# Altium project SmokeDetector.PrjPcb
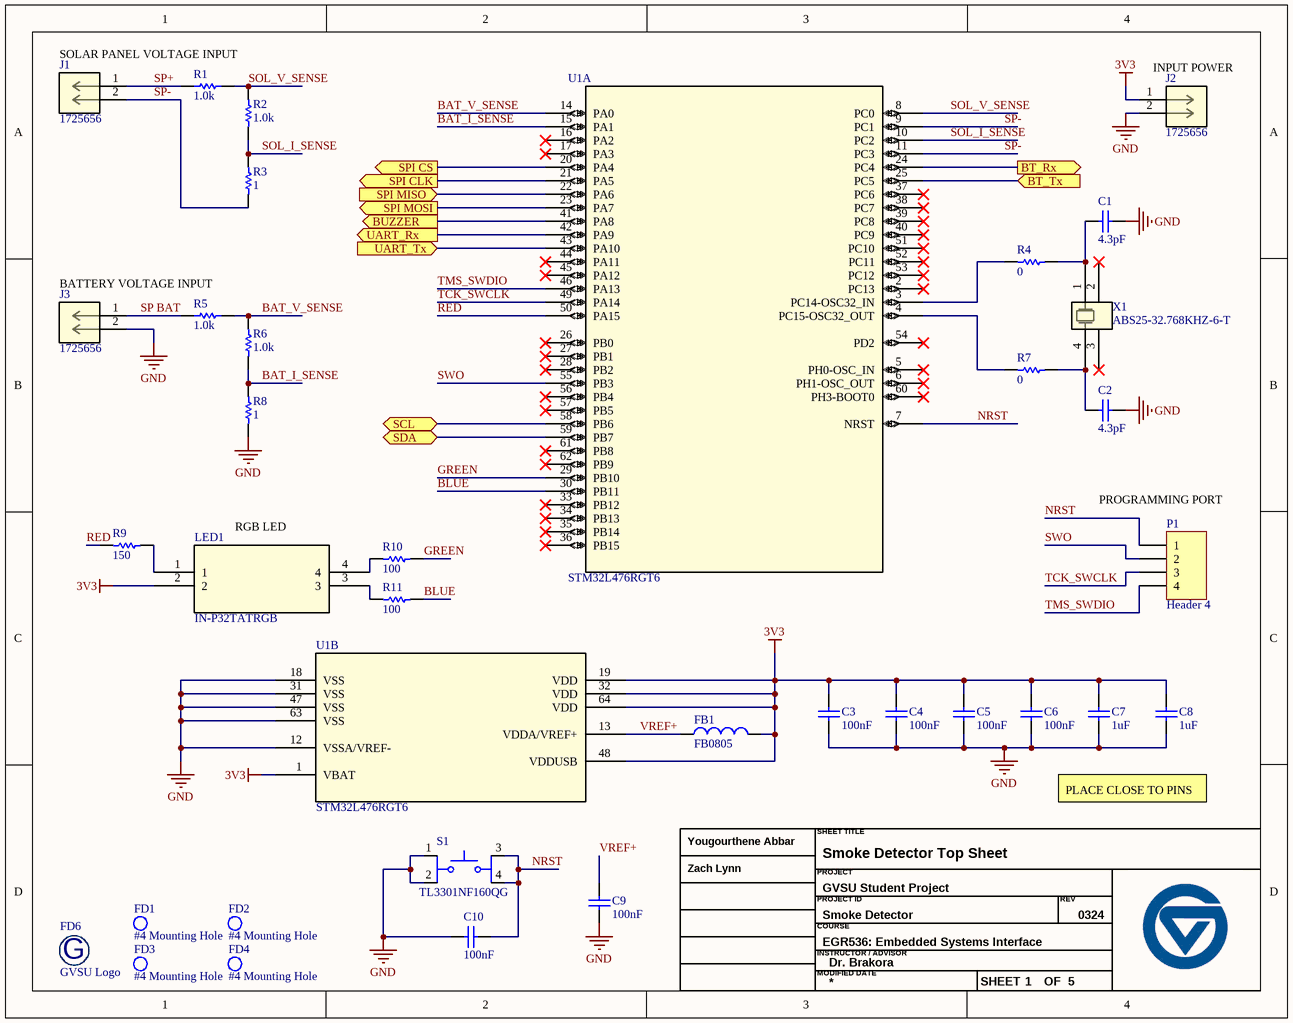
[diagram p0: SmokeDetector.SchDoc]
revision: 0324; release_date: Jan. 1, 1970; project_name: GVSU Student Project; project_id: Smoke Detector; member2: Zach Lynn; member1: Yougourthene Abbar; instructor: Dr. Brakora; gvsu_address3: 49504; gvsu_address2: 301 Fulton St. W, Grand Rapids MI; gvsu_address1: Kennedy Hall of Engineering; course: EGR536: Embedded Systems Interface
4 sheets, 62 parts. Net scope: flat (ports and power ports of the same name join across sheets).
Board file: SmokeDetector.PcbDoc
Sheets:
  SmokeDetector.SchDoc
  GasSensor.SchDoc
  USBtoUART.SchDoc
  BLE.SchDoc

## Sheet SmokeDetector.SchDoc: Smoke Detector Top Sheet
size A; SheetNumber: 1; SheetTotal: 5

### Parts
C1  value 4.3pF  [0402cap]  (hidden comment: C0402)
C2  value 4.3pF  [0402cap]  (hidden comment: C0402)
C3  value 100nF  [0402cap]  (hidden comment: C0402)
C4  value 100nF  [0402cap]  (hidden comment: C0402)
C5  value 100nF  [0402cap]  (hidden comment: C0402)
C6  value 100nF  [0402cap]  (hidden comment: C0402)
C7  value 1uF  [0402cap]  (hidden comment: C0402)
C8  value 1uF  [0805CAP]  (hidden comment: C0805)
C9  value 100nF  [0402cap]  (hidden comment: C0402)
C10  value 100nF  [0402cap]  (hidden comment: C0402)
FB1  FB0805  [0805CAP]
FD1  #4 Mounting Hole  [#4 Mounting Hole-Footprint-1]  (no BOM)
FD2  #4 Mounting Hole  [#4 Mounting Hole-Footprint-1]  (no BOM)
FD3  #4 Mounting Hole  [#4 Mounting Hole-Footprint-1]  (no BOM)
FD4  #4 Mounting Hole  [#4 Mounting Hole-Footprint-1]  (no BOM)
FD6  GVSU Logo  [GVSU Symbol Only]  (no BOM)
J1  1725656  [CONN_1725656_PXC]
J2  1725656  [CONN_1725656_PXC]
J3  1725656  [CONN_1725656_PXC]
LED1  IN-P32TATRGB  [4-PLCC_3P2X2P8_INL]
P1  Header 4  [HDR1X4]
R1  value 1.0k  [0805RES]  (hidden comment: R0805)
R2  value 1.0k  [0805RES]  (hidden comment: R0805)
R3  value 1  [0805RES]  (hidden comment: R0805)
R4  value 0  [0402RES]  (hidden comment: R0402)
R5  value 1.0k  [0805RES]  (hidden comment: R0805)
R6  value 1.0k  [0805RES]  (hidden comment: R0805)
R7  value 0  [0402RES]  (hidden comment: R0402)
R8  value 1  [0805RES]  (hidden comment: R0805)
R9  value 150  [0805RES]  (hidden comment: R0805)
R10  value 100  [0805RES]  (hidden comment: R0805)
R11  value 100  [0805RES]  (hidden comment: R0805)
S1  TL3301NF160QG  [SW_TL3301NF160QG]
U1  STM32L476RGT6  [LQFP64-10x10mm_STM]  (parts A,B of 2)
X1  ABS25-32.768KHZ-6-T  [X_ABS25_ABR]

### Ports
BT_Rx (out), BT_Tx (in), BUZZER (out), SCL (bidir), SDA (bidir), SPI CLK (out), SPI CS (out), SPI MISO (in), SPI MOSI (out), UART_Rx (out), UART_Tx (in)

### Nets
3V3: C3.2 C4.2 C5.2 C6.2 C7.2 C8.2 FB1.2 J2.1 LED1.2 U1.1(VBAT) U1.19(VDD) U1.32(VDD) U1.48(VDDUSB) U1.64(VDD)
GND: C1.2 C2.2 C3.1 C4.1 C5.1 C6.1 C7.1 C8.1 C9.1 C10.1 J2.2 J3.2 R8.1 S1.1 S1.2 U1.12(VSSA/VREF-) U1.18(VSS) U1.31(VSS) U1.47(VSS) U1.63(VSS)
BAT_I_SENSE: R6.1 R8.2 U1.15(PA1)
BAT_V_SENSE: R5.1 R6.2 U1.14(PA0)
BLUE: R11.2 U1.30(PB11)
BT_Rx: U1.24(PC4) ; port BT_Rx
BT_Tx: U1.25(PC5) ; port BT_Tx
BUZZER: U1.41(PA8) ; port BUZZER
GREEN: R10.2 U1.29(PB10)
NRST: C10.2 P1.1 S1.3 S1.4 U1.7(NRST)
RED: R9.1 U1.50(PA15)
SCL: U1.58(PB6) ; port SCL
SDA: U1.59(PB7) ; port SDA
SOL_I_SENSE: R2.1 R3.2 U1.10(PC2)
SOL_V_SENSE: R1.1 R2.2 U1.8(PC0)
SP BAT: J3.1 R5.2
SP+: J1.1 R1.2
SP-: J1.2 R3.1 U1.9(PC1) U1.11(PC3)
SPI CLK: U1.21(PA5) ; port SPI CLK
SPI CS: U1.20(PA4) ; port SPI CS
SPI MISO: U1.22(PA6) ; port SPI MISO
SPI MOSI: U1.23(PA7) ; port SPI MOSI
SWO: P1.2 U1.55(PB3)
TCK_SWCLK: P1.3 U1.49(PA14)
TMS_SWDIO: P1.4 U1.46(PA13)
UART_Rx: U1.42(PA9) ; port UART_Rx
UART_Tx: U1.43(PA10) ; port UART_Tx
VREF+: C9.2 FB1.1 U1.13(VDDA/VREF+)
NetC1_1: C1.1 R4.2 X1.1(CRYSTAL)
NetC2_1: C2.1 R7.2 X1.4(CRYSTAL)
NetLED1_1: LED1.1 R9.2
NetLED1_3: LED1.3 R11.1
NetLED1_4: LED1.4 R10.1
NetR4_1: R4.1 U1.3(PC14-OSC32_IN)
NetR7_1: R7.1 U1.4(PC15-OSC32_OUT)

Not connected (* = marked no-connect by the designer): U1 2(PC13)* 5(PH0-OSC_IN)* 6(PH1-OSC_OUT)* 16(PA2)* 17(PA3)* 26(PB0)* 27(PB1)* 28(PB2)* 33(PB12)* 34(PB13)* 35(PB14)* 36(PB15)* 37(PC6)* 38(PC7)* 39(PC8)* 40(PC9)* 44(PA11)* 45(PA12)* 51(PC10)* 52(PC11)* 53(PC12)* 54(PD2)* 56(PB4)* 57(PB5)* 60(PH3-BOOT0)* 61(PB8)* 62(PB9)*; X1 2(NC)* 3(NC)*

### Notes on the sheet
- SOLAR PANEL VOLTAGE INPUT
- (near J2) INPUT POWER
- BATTERY VOLTAGE INPUT
- (near P1) PROGRAMMING PORT
- (near LED1) RGB LED
- PLACE CLOSE TO PINS
- SHEET TITLE
- PROJECT
- PROJECT ID
- REV
- COURSE
- INSTRUCTOR / ADVISOR
- MODIFIED DATE
- SHEET
- OF
- (in symbol GVSU Logo) G

### Library data of the parts
C1-C7 C9 C10 = C0402: 0402 Ceramic Chip Capacitor - Standard
C8 = C0805: 0805 Ceramic Chip Capacitor - Standard
FB1 = FB0805: 0805 Multilayer Ferrite Power Bead; Manufacturer: KOA Speer; Manufacturer P/N: CAP2AFTTD221P; Vendor: Mouser; Vendor P/N: 660-CZP2AFTTD221P; Resistance @ 100MHz: 220; Price: 0.15
FD1-FD4 = #4 Mounting Hole: #4 clearance hole, unplated.
FD6 = GVSU Logo: GVSU Logo (Several Symbols)
J1-J3 = 1725656: No Description Available; Mfr_Name: Phoenix Contact; RefDes: RefDes; Type: Type
LED1 = IN-P32TATRGB: No Description Available; Mfr_Name: Inolux; RefDes: RefDes; Type: Type
P1 = Header 4: Header, 4-Pin; LatestRevisionDate: 17-Jul-2002; LatestRevisionNote: Re-released for DXP Platform.; Publisher: Altium Limited
R1-R3 R5 R6 R8-R11 = R0805: 0805 Chip Resistor - Standard
R4 R7 = R0402: 0402 Chip Resistor - Standard; ComponentLink1URL: *
S1 = TL3301NF160QG: <a href="https://pricing.snapeda.com/parts/TL3301NF160QG/E-Switch/view-part?ref=eda">Check availability</a> <a href="https://pricing.snapeda.com/parts/TL3301NF160QG/E-Switch/view-part?ref=eda">Check availability</a>; MF: {'manufacturer': u'E-Switch'}; Package: None; Price: None; Value: *; MP: TL3301NF160QG; Availability: Unavailable
U1 = STM32L476RGT6: No Description Available; Mfr_Name: STMicroelectronics; RefDes: RefDes; Type: Type
X1 = ABS25-32.768KHZ-6-T: No Description Available; Mfr_Name: Abracon; Type: Crystals; RefDes: RefDes

## Sheet GasSensor.SchDoc: BME688 Wiring
size A; SheetNumber: 2; SheetTotal: 5; SPICEModelCacheJFNWPNPT: <root> / <DocumentId>JFNWPNPT</DocumentId> / </root>
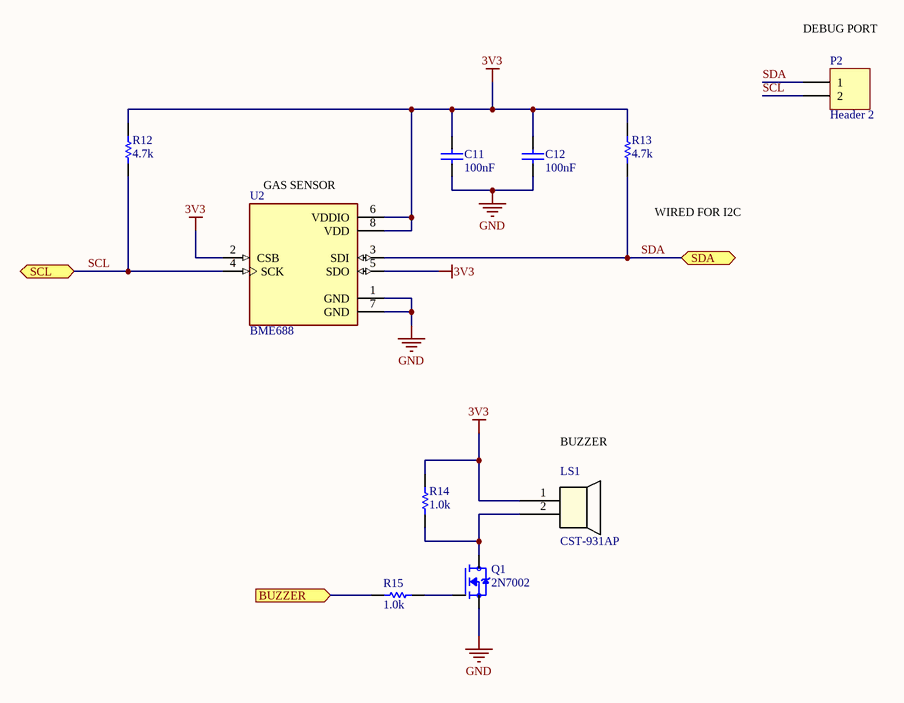
[diagram p1: GasSensor.SchDoc]

### Parts
C11  value 100nF  [0402cap]  (hidden comment: C0402)
C12  value 100nF  [0402cap]  (hidden comment: C0402)
LS1  CST-931AP  [CST-931AP_CUD]
P2  Header 2  [HDR1X2]
Q1  2N7002  [SOT95P240X111-3N]
R12  value 4.7k  [0402RES]  (hidden comment: R0402)
R13  value 4.7k  [0402RES]  (hidden comment: R0402)
R14  value 1.0k  [0805RES]  (hidden comment: R0805)
R15  value 1.0k  [0402RES]  (hidden comment: R0402)
U2  BME688  [IC_BME688]

### Ports
BUZZER (in), SCL (bidir), SDA (bidir)

### Nets
3V3: C11.2 C12.2 LS1.1 R12.2 R13.2 R14.2 U2.2(CSB) U2.5(SDO) U2.6(VDDIO) U2.8(VDD)
GND: C11.1 C12.1 Q1.2(S) U2.1(GND) U2.7(GND)
BUZZER: R15.2 ; port BUZZER
SCL: P2.2 R12.1 U2.4(SCK) ; port SCL
SDA: P2.1 R13.1 U2.3(SDI) ; port SDA
NetLS1_2: LS1.2 Q1.3(D) R14.1
NetQ1_1: Q1.1(G) R15.1

### Notes on the sheet
- (near P2) DEBUG PORT
- (near U2) GAS SENSOR
- (near R13) WIRED FOR I2C
- BUZZER

### Library data of the parts
C11 C12 = C0402: 0402 Ceramic Chip Capacitor - Standard
LS1 = CST-931AP: No Description Available; Mfr_Name: CUI Devices; RefDes: RefDes; Type: Type
P2 = Header 2: Header, 2-Pin; LatestRevisionDate: 17-Jul-2002; LatestRevisionNote: Re-released for DXP Platform.; Publisher: Altium Limited
Q1 = 2N7002: N-Channel 60V 280mA (Ta) 350mW (Ta) Surface Mount SOT-23-3 (TO-236); MP: altium_native_batch; Package: None; Price: None; Availability: Unavailable; Value: *
R12 R13 R15 = R0402: 0402 Chip Resistor - Standard; ComponentLink1URL: *
R14 = R0805: 0805 Chip Resistor - Standard
U2 = BME688: Gas sensor measuring relative humidity, barometric pressure, ambient temperature and gas (VOC); Package: None; MP: BME688; Price: None; Availability: Unavailable; Value: *

## Sheet USBtoUART.SchDoc
size A; SheetNumber: 4; SheetTotal: 5
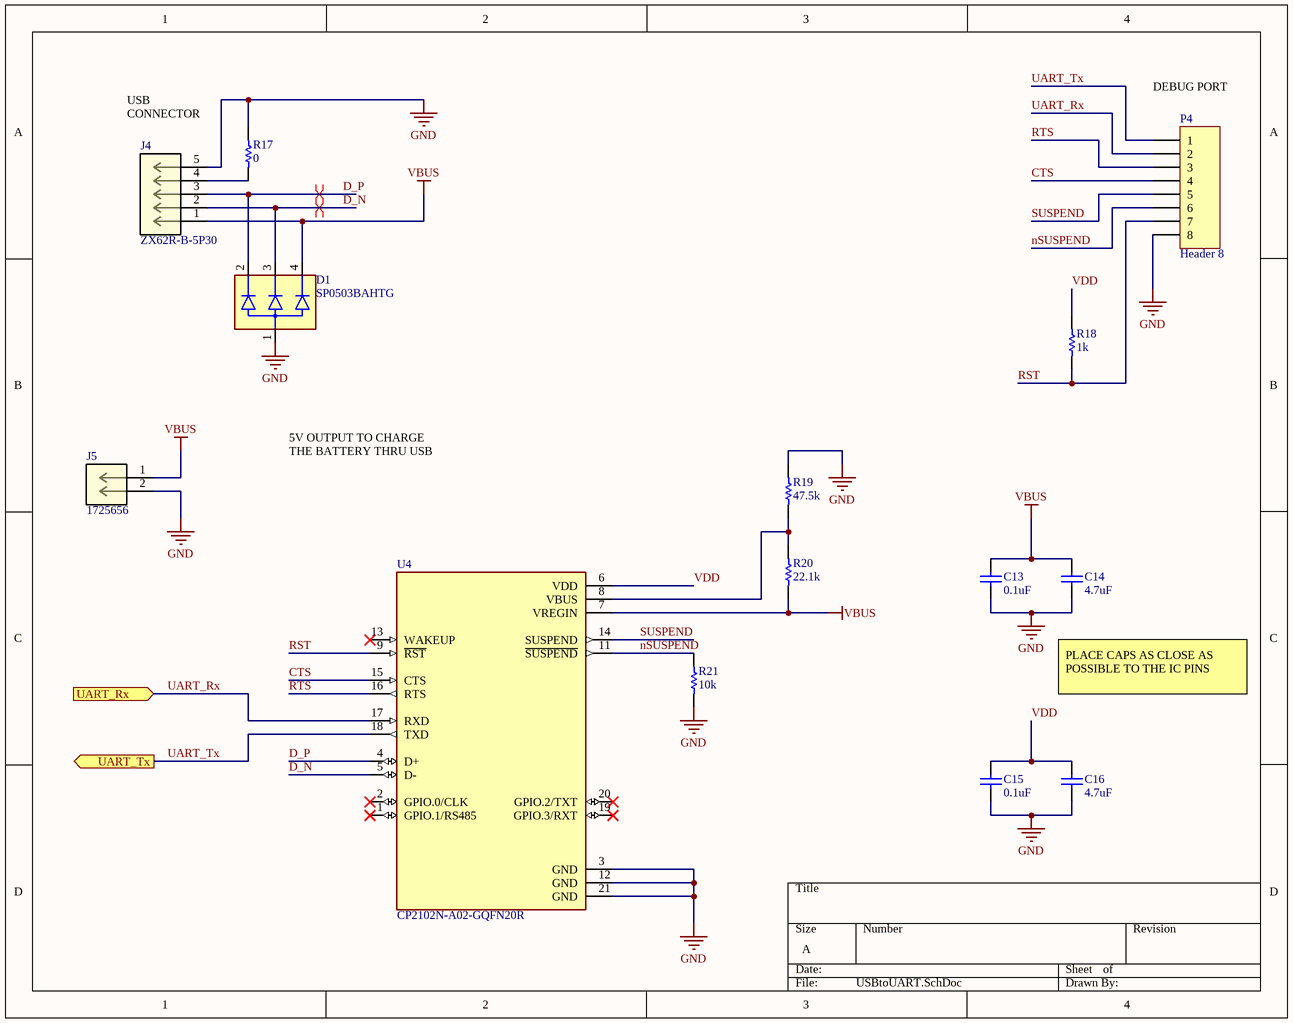
[diagram p2: USBtoUART.SchDoc]

### Parts
C13  value 0.1uF  [0402cap]  (hidden comment: C0402)
C14  value 4.7uF  [0805CAP]  (hidden comment: C0805)
C15  value 0.1uF  [0402cap]  (hidden comment: C0402)
C16  value 4.7uF  [0805CAP]  (hidden comment: C0805)
D1  SP0503BAHTG  [SOT143]
J4  ZX62R-B-5P30  [CONN_ZX62R-B-5P30_HIR]
J5  1725656  [CONN_1725656_PXC]
P4  Header 8  [HDR1X8]
R17  value 0  [0805RES]  (hidden comment: R0805)
R18  value 1k  [0402RES]  (hidden comment: R0402)
R19  value 47.5k  [0805RES]  (hidden comment: R0805)
R20  value 22.1k  [0805RES]  (hidden comment: R0805)
R21  value 10k  [0402RES]  (hidden comment: R0402)
U4  CP2102N-A02-GQFN20R  [SILABS_CP2102N-A02-GQFN20R]

### Ports
UART_Rx (in), UART_Tx (out)

### Nets
GND: C13.1 C14.1 C15.1 C16.1 D1.1 J4.5 J5.2 P4.8 R17.2 R19.2 R21.1 U4.3(GND) U4.12(GND) U4.21(GND)
VBUS: C13.2 C14.2 D1.4 J4.1 J5.1 R20.1 U4.7(VREGIN)
CTS: P4.4 U4.15(CTS)
D_N: D1.3 J4.2 U4.5(D-)
D_P: D1.2 J4.3 U4.4(D+)
nSUSPEND: P4.6 R21.2 U4.11(~{SUSPEND})
RST: P4.7 R18.1 U4.9(~{RST})
RTS: P4.3 U4.16(RTS)
SUSPEND: P4.5 U4.14(SUSPEND)
UART_Rx: P4.2 U4.17(RXD) ; port UART_Rx
UART_Tx: P4.1 U4.18(TXD) ; port UART_Tx
VDD: C15.2 C16.2 R18.2 U4.6(VDD)
NetJ4_4: J4.4 R17.1
NetR19_1: R19.1 R20.2 U4.8(VBUS)

Not connected (* = marked no-connect by the designer): U4 1(GPIO.1/RS485)* 2(GPIO.0/CLK)* 13(WAKEUP)* 19(GPIO.3/RXT)* 20(GPIO.2/TXT)*

### Layout directives
differential pair: D_N, D_P

### Notes on the sheet
- (near P4) DEBUG PORT
- USB CONNECTOR
- (near D1) Type @ to refer to a designator
- 5V OUTPUT TO CHARGE THE BATTERY THRU USB
- PLACE CAPS AS CLOSE AS POSSIBLE TO THE IC PINS

### Library data of the parts
C13 C15 = C0402: 0402 Ceramic Chip Capacitor - Standard
C14 C16 = C0805: 0805 Ceramic Chip Capacitor - Standard
D1 = SP0503BAHTG: TVS DIODE 5.5VWM 8.5VC SOT143 <a href="https://pricing.snapeda.com/parts/SP0503BAHTG/Littelfuse/view-part?ref=eda">Check availability</a>; MF: {'manufacturer': u'Littelfuse Inc.'}; Package: None; Price: None; Value: *; MP: SP0503BAHTG; Availability: Unavailable
J4 = ZX62R-B-5P30: No Description Available; Mfr_Name: Hirose; RefDes: RefDes; Type: Type
J5 = 1725656: as J1 on sheet SmokeDetector; RefDes: RefDes; Type: Type
P4 = Header 8: Header, 8-Pin; LatestRevisionDate: 17-Jul-2002; LatestRevisionNote: Re-released for DXP Platform.; Publisher: Altium Limited
R17 R19 R20 = R0805: 0805 Chip Resistor - Standard
R18 R21 = R0402: 0402 Chip Resistor - Standard; ComponentLink1URL: *
U4 = CP2102N-A02-GQFN20R: USB Bridge, USB to UART USB 2.0 UART Interface 20-QFN (3x3); MF: Silicon Labs; SnapEDA_Link: https://www.snapeda.com/parts/CP2102N-A02-GQFN20R/Silicon+Labs/view-part/?ref=snap; Package: None; Value: *; MP: CP2102N-A02-GQFN20R; Check_prices: https://www.snapeda.com/parts/CP2102N-A02-GQFN20R/Silicon+Labs/view-part/?ref=eda

## Sheet BLE.SchDoc
size A; SheetNumber: 5; SheetTotal: 5
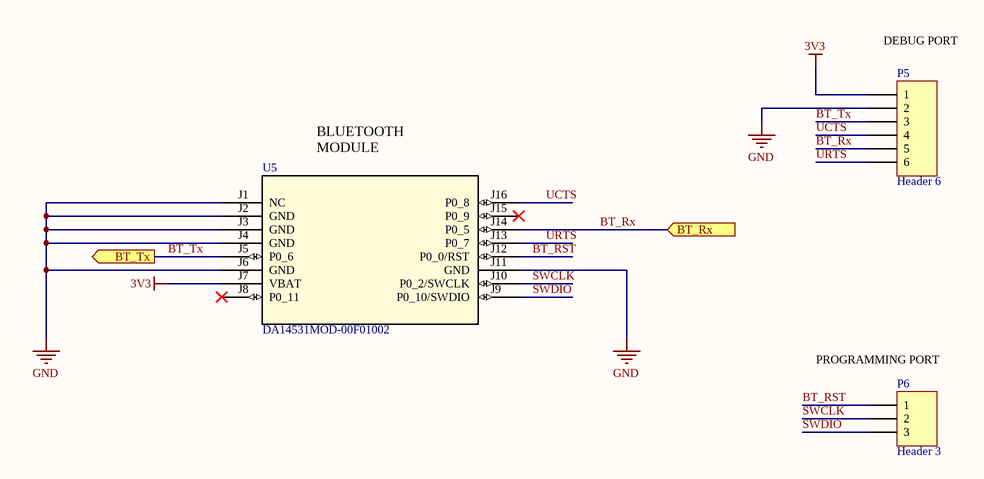
[diagram p3: BLE.SchDoc]

### Parts
P5  Header 6  [HDR1X6]
P6  Header 3  [HDR1X3]
U5  DA14531MOD-00F01002  [DA14531MOD_REN]

### Ports
BT_Rx (in), BT_Tx (out)

### Nets
3V3: P5.1 U5.J7(VBAT)
GND: P5.2 U5.J1(NC) U5.J2(GND) U5.J3(GND) U5.J4(GND) U5.J6(GND) U5.J11(GND)
BT_RST: P6.1 U5.J12(P0_0/RST)
BT_Rx: P5.5 U5.J14(P0_5) ; port BT_Rx
BT_Tx: P5.3 U5.J5(P0_6) ; port BT_Tx
SWCLK: P6.2 U5.J10(P0_2/SWCLK)
SWDIO: P6.3 U5.J9(P0_10/SWDIO)
UCTS: P5.4 U5.J16(P0_8)
URTS: P5.6 U5.J13(P0_7)

Not connected (* = marked no-connect by the designer): U5 J8(P0_11)* J15(P0_9)*

### Notes on the sheet
- (near P5) DEBUG PORT
- (near U5) BLUETOOTH MODULE
- (near P6) PROGRAMMING PORT

### Library data of the parts
P5 = Header 6: Header, 6-Pin; LatestRevisionDate: 17-Jul-2002; LatestRevisionNote: Re-released for DXP Platform.; Publisher: Altium Limited
P6 = Header 3: Header, 3-Pin; LatestRevisionDate: 17-Jul-2002; LatestRevisionNote: Re-released for DXP Platform.; Publisher: Altium Limited
U5 = DA14531MOD-00F01002: No Description Available; Mfr_Name: Renesas Electronics; RefDes: RefDes; Type: Type

## Nets that join several sheets
3V3: SmokeDetector (14 pins), GasSensor (10 pins), BLE (P5.1 U5.J7)
GND: SmokeDetector (20 pins), GasSensor (5 pins), USBtoUART (14 pins), BLE (7 pins)
BT_Rx: SmokeDetector (U1.24), BLE (P5.5 U5.J14)
BT_Tx: SmokeDetector (U1.25), BLE (P5.3 U5.J5)
BUZZER: SmokeDetector (U1.41), GasSensor (R15.2)
SCL: SmokeDetector (U1.58), GasSensor (P2.2 R12.1 U2.4)
SDA: SmokeDetector (U1.59), GasSensor (P2.1 R13.1 U2.3)
UART_Rx: SmokeDetector (U1.42), USBtoUART (P4.2 U4.17)
UART_Tx: SmokeDetector (U1.43), USBtoUART (P4.1 U4.18)

## Assembly variants
STANDARD CONFIG: all parts fitted